# EAGLE schematic uv_brick (EAGLE 7.2.0)
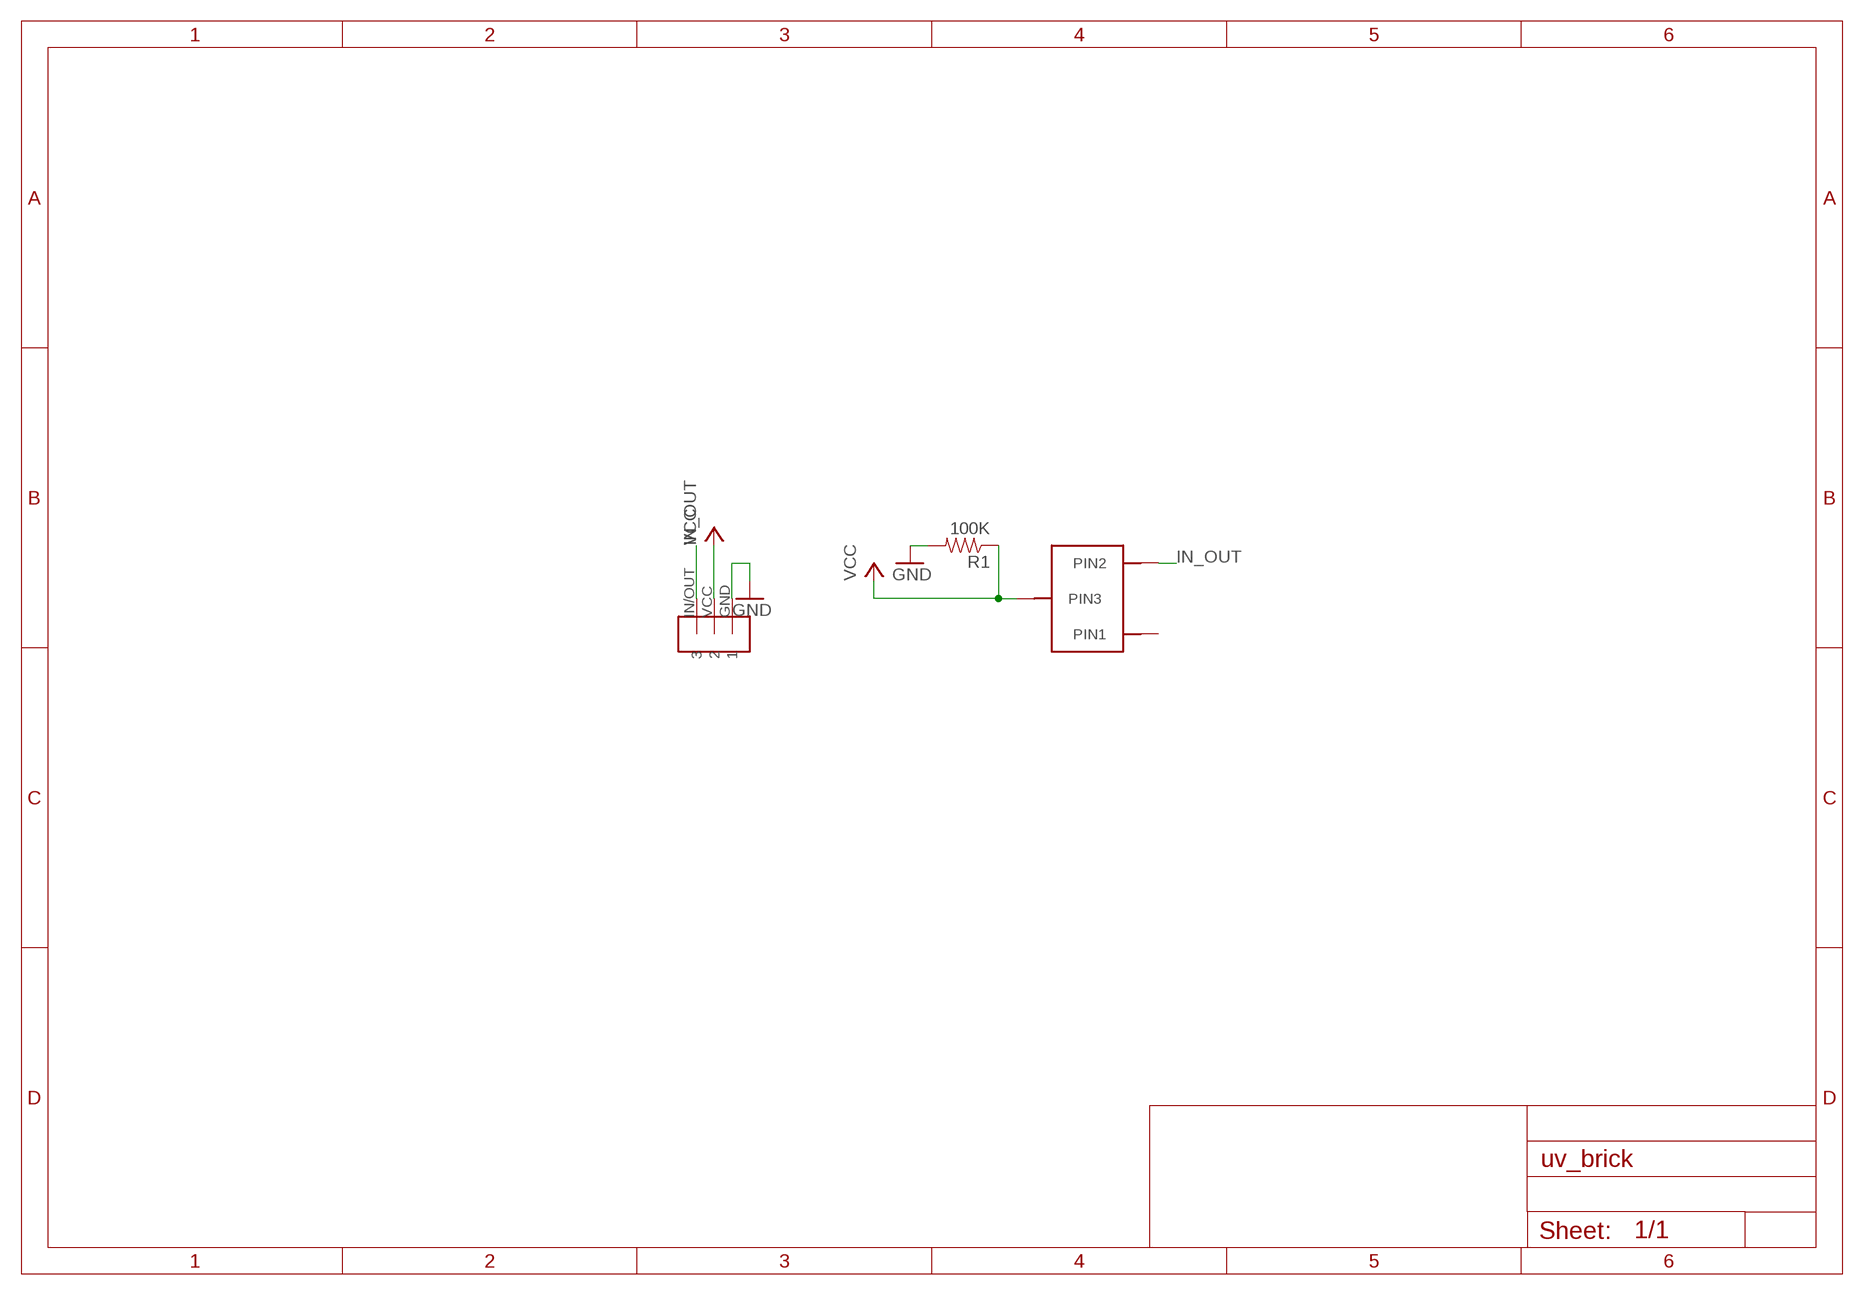
[diagram p0: schematic, sheet 1]

## Parts
R1  100K  RESISTOR0603-RES  [0603-RES]
U$1  GAASP-G6262  [GAASP-G6262]
U$2  BRICK-3PIN  [BRICK_3PIN]

## Nets
GND: R1.2 U$2.GND
IN_OUT: U$1.2(PIN2) U$2.IN/OUT
VCC: R1.1 U$1.3(PIN3) U$2.VCC
Unconnected: U$1.1(PIN1)

## Library data of the parts
R1 = SparkFun:RESISTOR: Resistor Basic schematic elements and footprints for 0603, 1206, and PTH resistors.
U$1 = gclue:GAASP-G6262
U$2 = gclue:BRICK-3PIN